# EAGLE design thermistor-vacuum-sensor (EAGLE 6.2)
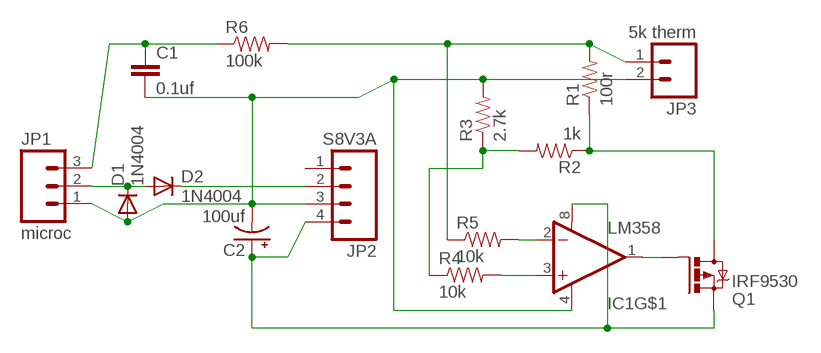
[diagram p0: schematic, sheet 1]

## Parts
C1  0.1uf  CAPPTH  [CAP-PTH-SMALL]
C2  100uf  CAP_POLPTH1  [CPOL-RADIAL-100UF-25V]
D1  1N4004  [DO41-10]
D2  1N4004  [DO41-10]
IC1  LM358  [DIP08]
JP1  microc  M03LONGPADS  [1X03_LONGPADS]
JP2  S8V3A  M04LONGPADS  [1X04_LONGPADS]
JP3  5k therm  M02LOCK_LONGPADS  [1X02_LOCK_LONGPADS]
Q1  IRF9530  [TO220BV]
R1  100r  RESISTORAXIAL-0.3-FRANK  [AXIAL-0.3]
R2  1k  RESISTORAXIAL-0.3-FRANK  [AXIAL-0.3]
R3  2.7k  RESISTORAXIAL-0.3-FRANK  [AXIAL-0.3]
R4  10k  RESISTORAXIAL-0.3-FRANK  [AXIAL-0.3]
R5  10k  RESISTORAXIAL-0.3-FRANK  [AXIAL-0.3]
R6  100k  RESISTORAXIAL-0.3-FRANK  [AXIAL-0.3]

## Nets
N$1: D1.C D2.A JP1.2
N$2: D2.C JP2.2
N$3: C1.2 C2.2(-) D1.A IC1.4(V-) JP1.1 JP2.3 JP3.2 R3.P$2
N$4: C2.1(+) IC1.8(V+) JP2.4 Q1.S
N$5: C1.1 JP1.3 R6.P$1
N$6: IC1.2(-IN) R5.P$2
N$7: IC1.3(+IN) R4.P$2
N$8: IC1.1(OUT) Q1.G
N$9: JP3.1 R1.P$2 R5.P$1 R6.P$2
N$10: R2.P$2 R3.P$1 R4.P$1
N$11: Q1.D R1.P$1 R2.P$1
Unconnected: IC1.5(+IN) IC1.6(-IN) IC1.7(OUT) JP2.1

## Library data of the parts
C1 = SparkFun-Passives:CAP: Capacitor Standard 0603 ceramic capacitor, and 0.1" leaded capacitor.
C2 = SparkFun-Passives:CAP_POL: Capacitor Polarized These are standard SMD and PTH capacitors. Normally 10uF, 47uF, and 100uF in electrolytic and tantalum varieties. Always verify the external diameter of the through hole cap, it varies with capacity, voltage, and manufacturer. The EIA devices should be standard.
D1 D2 = diode:1N4004: DIODE general purpose rectifier, 1 A
IC1 = SparkFun-AnalogIC:LM358: Jellybean op-amp
JP1 = SparkFun-Connectors:M03: Header 3 Standard 3-pin 0.1" header. Use with straight break away headers (SKU : PRT-00116), right angle break away headers (PRT-00553), swiss pins (PRT-00743), machine pins (PRT-00117), and female headers (PRT-00115). Molex polarized connector foot print use with SKU : PRT-08232 with associated crimp pins and housings.
JP2 = SparkFun-Connectors:M04: Header 4 Standard 4-pin 0.1" header. Use with straight break away headers (SKU : PRT-00116), right angle break away headers (PRT-00553), swiss pins (PRT-00743), machine pins (PRT-00117), and female headers (PRT-00115). Molex polarized connector foot print use with SKU : PRT-08231 with associated crimp pins and housings. 1MM SMD Version SKU: PRT-10208
JP3 = SparkFun-Connectors:M02: Header 2 Standard 2-pin 0.1" header. Use with straight break away headers (SKU : PRT-00116), right angle break away headers (PRT-00553), swiss pins (PRT-00743), machine pins (PRT-00117), and female headers (PRT-00115). Molex polarized connector foot print use with SKU : PRT-08233 with associated crimp pins and housings.
Q1 = transistor-power:IRF9530: P-CHANNEL HEXFET POWER-MOS-FET Source: http://www.irf.com/product-info/datasheets/data/irf9530.pdf
R1-R6 = SparkFun-Passives:RESISTOR: Resistor Basic schematic elements and footprints for 0603, 1206, and PTH resistors.

## Board
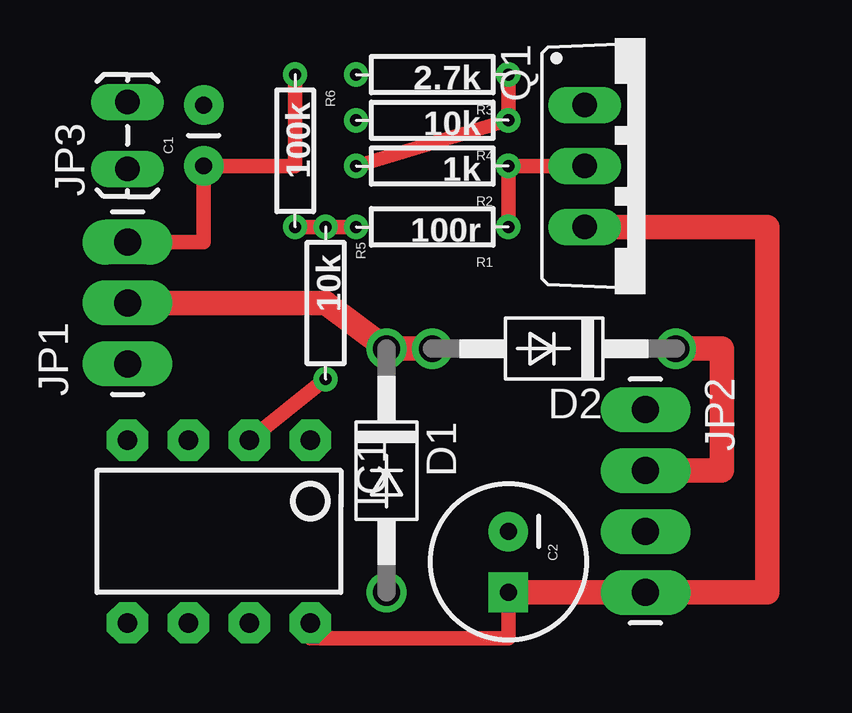
[diagram p1: board, top side]
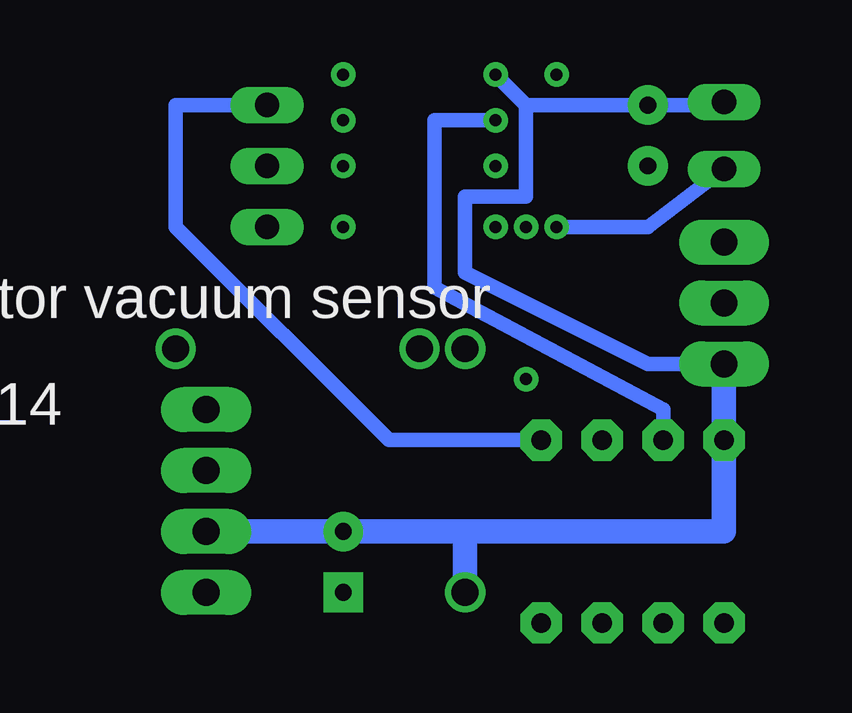
[diagram p2: board, bottom side, seen from below]

No outline drawn. Coordinates in mm, seen from the top.
Copper layers (1*16): Top 0.035mm / dielectric 1.5mm / Bottom 0.035mm
Design rules: minimum track width 10mil, minimum drill 24mil, track to track 8mil, track to pad 8mil, pad to pad 8mil, via to via 8mil, smd to smd 8mil, copper to edge 40mil, drill to drill 8mil, minimum pad ring 10mil, minimum via ring 8mil, stop-mask expansion 4mil, vias tented up to drill 0mil, thermal gap 10mil
Holes 3.2 mm at 41.91,22.86 41.91,2.54

### Footprints (pad centres in the part's own frame; a part is rotated, then mirrored left to right if it is on the bottom)
CAP-PTH-SMALL = drill 0.7 pad 1.651: 1 0,0; 2 2.54,0
CPOL-RADIAL-100UF-25V = drill 0.7 pad 1.651 square: 1 1.27,0 | drill 0.7 pad 1.651: 2 -1.27,0
DO41-10 = drill 1.118: A 5.08,0; C -5.08,0
DIP08 = drill 0.813 pad 1.727 octagon: 1 -3.81,-3.81; 2 -1.27,-3.81; 3 1.27,-3.81; 4 3.81,-3.81; 5 3.81,3.81; 6 1.27,3.81; 7 -1.27,3.81; 8 -3.81,3.81
1X03_LONGPADS = drill 1.118 pad 1.88 long: 1 0,0; 2 2.54,0; 3 5.08,0
1X04_LONGPADS = drill 1.118 pad 1.88 long: 1 0,0; 2 2.54,0; 3 5.08,0; 4 7.62,0
1X02_LOCK_LONGPADS = drill 1.016 long: 1 -0.127,0; 2 2.667,0
TO220BV = drill 1.016 long: D 0,-2.54; G -2.54,-2.54; S 2.54,-2.54
AXIAL-0.3 = drill 0.5 pad 1.016: P$1 -3.81,0; P$2 2.54,0

### Placement (x,y rotation side)
C1  5.71,20.32 90 top
C2  18.41,3.81 270 top
D1  13.34,7.62 270 top
D2  20.32,12.7 180 top
IC1  6.35,5.08 180 top
JP1  2.54,12.06 90 top
JP2  24.13,10.16 270 top
JP3  2.54,20.32 90 top
Q1  24.13,20.32 270 top
R1  14.61,17.78 180 top
R2  14.61,20.32 180 top
R3  14.61,24.13 180 top
R4  14.61,22.23 180 top
R5  10.79,13.97 270 top
R6  9.53,20.32 270 top

### Tracks (layer width: path | path; a pad name or v marks a point on that pad's centre or on a via)
N$1
  Top 1.016: JP1.2 10.79,14.61 D1.C D2.A
N$2
  Top 1.016: D2.C 27.3,12.7 27.3,7.62 JP2.2
N$3
  Bottom 0.61: JP3.2 2.54,22.86 C1.2 10.79,22.86 | 10.79,22.86 R3.P$2 | JP1.1 5.71,12.06 13.34,15.88 13.34,19.05 10.79,19.05 10.79,22.86
  Bottom 1.016: JP1.1 IC1.4 2.54,5.08 13.34,5.08 | D1.A 13.34,5.08 | 13.34,5.08 C2.2 JP2.3
N$4
  Top 0.61: C2.1 18.41,0.64 10.16,0.64 IC1.8
  Top 1.016: C2.1 JP2.4 29.21,2.54 29.21,17.78 Q1.S
N$5
  Top 0.61: JP1.3 5.71,17.14 C1.1 9.53,20.32 R6.P$1
N$6
  Top 0.61: IC1.2 R5.P$2
N$7
  Bottom 0.61: R4.P$2 14.61,22.23 14.61,15.24 5.08,10.16 IC1.3
N$8
  Bottom 0.61: IC1.1 16.51,8.89 25.4,17.78 25.4,22.86 Q1.G
N$9
  Top 0.61: R1.P$2 R5.P$1 R6.P$2
  Bottom 0.61: R6.P$2 5.71,17.78 JP3.1
N$10
  Top 0.61: R3.P$1 R4.P$1 R2.P$2
N$11
  Top 0.61: R1.P$1 R2.P$1 Q1.D

### Text on the board
bNames: Thermistor vacuum sensor | v20130414